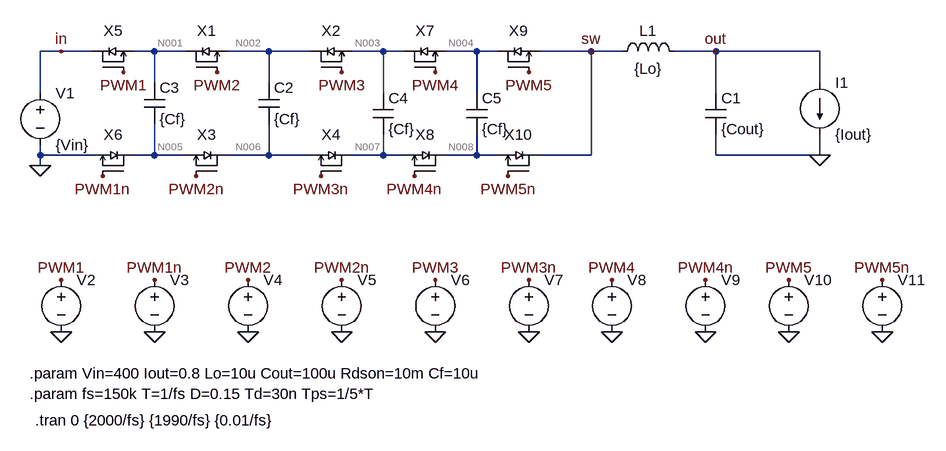
[diagram p0: schematic FCML_6Level_idealSW.asc]
FCML_6Level_idealSW.asc, the LTspice schematic file:
Version 4
SHEET 1 1308 680
WIRE -16 48 -48 48
WIRE 32 48 -16 48
WIRE 128 48 96 48
WIRE 176 48 128 48
WIRE 304 48 240 48
WIRE 368 48 304 48
WIRE 480 48 432 48
WIRE 512 48 480 48
WIRE 624 48 576 48
WIRE 656 48 624 48
WIRE 800 48 720 48
WIRE 848 48 800 48
WIRE 992 48 928 48
WIRE 1152 48 992 48
WIRE 128 96 128 48
WIRE 304 96 304 48
WIRE 1152 96 1152 48
WIRE -48 112 -48 48
WIRE 480 112 480 48
WIRE 624 112 624 48
WIRE 992 112 992 48
WIRE -48 208 -48 192
WIRE 32 208 -48 208
WIRE 128 208 128 160
WIRE 128 208 96 208
WIRE 176 208 128 208
WIRE 304 208 304 160
WIRE 304 208 240 208
WIRE 368 208 304 208
WIRE 480 208 480 176
WIRE 480 208 432 208
WIRE 512 208 480 208
WIRE 624 208 624 176
WIRE 624 208 576 208
WIRE 656 208 624 208
WIRE 800 208 800 48
WIRE 800 208 720 208
WIRE 992 208 992 176
WIRE 1152 208 1152 176
WIRE 1152 208 992 208
WIRE -48 224 -48 208
FLAG -48 224 0
FLAG 1152 208 0
FLAG -16 480 0
FLAG -16 400 PWM1
FLAG 128 480 0
FLAG 128 400 PWM1n
FLAG 272 480 0
FLAG 272 400 PWM2
FLAG 416 480 0
FLAG 416 400 PWM2n
FLAG -16 48 in
FLAG 800 48 sw
FLAG 992 48 out
FLAG 192 240 PWM2n
FLAG 416 80 PWM3
FLAG 384 240 PWM3n
FLAG 80 80 PWM1
FLAG 48 240 PWM1n
FLAG 560 480 0
FLAG 560 400 PWM3
FLAG 704 480 0
FLAG 704 400 PWM3n
FLAG 560 80 PWM4
FLAG 528 240 PWM4n
FLAG 832 480 0
FLAG 832 400 PWM4
FLAG 976 480 0
FLAG 976 400 PWM4n
FLAG 224 80 PWM2
FLAG 704 80 PWM5
FLAG 672 240 PWM5n
FLAG 1104 480 0
FLAG 1104 400 PWM5
FLAG 1248 480 0
FLAG 1248 400 PWM5n
SYMBOL voltage -48 96 R0
WINDOW 123 0 0 Left 0
WINDOW 39 0 0 Left 0
SYMATTR InstName V1
SYMATTR Value {Vin}
SYMBOL IdealSwitch\\IdealSW 208 64 R0
SYMATTR InstName X1
SYMATTR SpiceLine Rdson = {Rdson}
SYMBOL IdealSwitch\\IdealSW 400 64 R0
SYMATTR InstName X2
SYMATTR SpiceLine Rdson = {Rdson}
SYMBOL IdealSwitch\\IdealSW 208 224 M0
SYMATTR InstName X3
SYMATTR SpiceLine Rdson = {Rdson}
SYMBOL IdealSwitch\\IdealSW 400 224 M0
SYMATTR InstName X4
SYMATTR SpiceLine Rdson = {Rdson}
SYMBOL ind 832 64 R270
WINDOW 0 32 56 VTop 2
WINDOW 3 5 56 VBottom 2
SYMATTR InstName L1
SYMATTR Value {Lo}
SYMATTR SpiceLine Rser=20m
SYMBOL cap 976 112 R0
SYMATTR InstName C1
SYMATTR Value {Cout}
SYMATTR SpiceLine Rser=1m
SYMBOL current 1152 96 R0
WINDOW 123 0 0 Left 0
WINDOW 39 0 0 Left 0
SYMATTR InstName I1
SYMATTR Value {Iout}
SYMBOL cap 288 96 R0
SYMATTR InstName C2
SYMATTR Value {Cf}
SYMATTR SpiceLine Rser=1m
SYMBOL voltage -16 384 R0
WINDOW 3 24 96 Invisible 2
WINDOW 123 0 0 Left 0
WINDOW 39 0 0 Left 0
SYMATTR Value PULSE(0 5 0 1n 1n {D*T} {T})
SYMATTR InstName V2
SYMBOL voltage 128 384 R0
WINDOW 3 24 96 Invisible 2
SYMATTR Value PULSE(0 5 {D*T+Td} 1n 1n {T-D*T-2*Td} {T})
SYMATTR InstName V3
SYMBOL voltage 272 384 R0
WINDOW 3 24 96 Invisible 2
WINDOW 123 0 0 Left 0
WINDOW 39 0 0 Left 0
SYMATTR Value PULSE(0 5 {Tps} 1n 1n {D*T} {T})
SYMATTR InstName V4
SYMBOL voltage 416 384 R0
WINDOW 3 24 96 Invisible 2
WINDOW 123 0 0 Left 0
WINDOW 39 0 0 Left 0
SYMATTR Value PULSE(0 5 {Tps+D*T+Td} 1n 1n {T-D*T-2*Td} {T})
SYMATTR InstName V5
SYMBOL IdealSwitch\\IdealSW 64 64 R0
SYMATTR InstName X5
SYMATTR SpiceLine Rdson = {Rdson}
SYMBOL IdealSwitch\\IdealSW 64 224 M0
SYMATTR InstName X6
SYMATTR SpiceLine Rdson = {Rdson}
SYMBOL cap 112 96 R0
SYMATTR InstName C3
SYMATTR Value {Cf}
SYMATTR SpiceLine Rser=1m
SYMBOL voltage 560 384 R0
WINDOW 3 24 96 Invisible 2
WINDOW 123 0 0 Left 0
WINDOW 39 0 0 Left 0
SYMATTR Value PULSE(0 5 {Tps*2} 1n 1n {D*T} {T})
SYMATTR InstName V6
SYMBOL voltage 704 384 R0
WINDOW 3 24 96 Invisible 2
WINDOW 123 0 0 Left 0
WINDOW 39 0 0 Left 0
SYMATTR Value PULSE(0 5 {Tps*2+D*T+Td} 1n 1n {T-D*T-2*Td} {T})
SYMATTR InstName V7
SYMBOL IdealSwitch\\IdealSW 544 64 R0
SYMATTR InstName X7
SYMATTR SpiceLine Rdson = {Rdson}
SYMBOL IdealSwitch\\IdealSW 544 224 M0
SYMATTR InstName X8
SYMATTR SpiceLine Rdson = {Rdson}
SYMBOL cap 464 112 R0
SYMATTR InstName C4
SYMATTR Value {Cf}
SYMATTR SpiceLine Rser=1m
SYMBOL voltage 832 384 R0
WINDOW 3 24 96 Invisible 2
WINDOW 123 0 0 Left 0
WINDOW 39 0 0 Left 0
SYMATTR Value PULSE(0 5 {Tps*3} 1n 1n {D*T} {T})
SYMATTR InstName V8
SYMBOL voltage 976 384 R0
WINDOW 3 24 96 Invisible 2
WINDOW 123 0 0 Left 0
WINDOW 39 0 0 Left 0
SYMATTR Value PULSE(0 5 {Tps*3+D*T+Td} 1n 1n {T-D*T-2*Td} {T})
SYMATTR InstName V9
SYMBOL IdealSwitch\\IdealSW 688 64 R0
SYMATTR InstName X9
SYMATTR SpiceLine Rdson = {Rdson}
SYMBOL IdealSwitch\\IdealSW 688 224 M0
SYMATTR InstName X10
SYMATTR SpiceLine Rdson = {Rdson}
SYMBOL cap 608 112 R0
SYMATTR InstName C5
SYMATTR Value {Cf}
SYMATTR SpiceLine Rser=1m
SYMBOL voltage 1104 384 R0
WINDOW 3 24 96 Invisible 2
WINDOW 123 0 0 Left 0
WINDOW 39 0 0 Left 0
SYMATTR Value PULSE(0 5 {Tps*4} 1n 1n {D*T} {T})
SYMATTR InstName V10
SYMBOL voltage 1248 384 R0
WINDOW 3 24 96 Invisible 2
WINDOW 123 0 0 Left 0
WINDOW 39 0 0 Left 0
SYMATTR Value PULSE(0 5 {Tps*4+D*T+Td} 1n 1n {T-D*T-2*Td} {T})
SYMATTR InstName V11
TEXT -64 544 Left 2 !.param Vin=400 Iout=0.8 Lo=10u Cout=100u Rdson=10m Cf=10u\n.param fs=150k T=1/fs D=0.15 Td=30n Tps=1/5*T
TEXT -56 616 Left 2 !.tran 0 {2000/fs} {1990/fs} {0.01/fs}

The netlist it stands for:
* FCML_6Level_idealSW.asc
V1 in 0 {Vin}
XX1 N001 PWM2 N002 IdealSW params: Rdson = {Rdson}  ; pins D G S
XX2 N002 PWM3 N003 IdealSW params: Rdson = {Rdson}  ; pins D G S
XX3 N006 PWM2n N005 IdealSW params: Rdson = {Rdson}  ; pins D G S
XX4 N007 PWM3n N006 IdealSW params: Rdson = {Rdson}  ; pins D G S
L1 sw out {Lo} Rser=20m
C1 out 0 {Cout} Rser=1m
I1 out 0 {Iout}
C2 N002 N006 {Cf} Rser=1m
V2 PWM1 0 PULSE(0 5 0 1n 1n {D*T} {T})
V3 PWM1n 0 PULSE(0 5 {D*T+Td} 1n 1n {T-D*T-2*Td} {T})
V4 PWM2 0 PULSE(0 5 {Tps} 1n 1n {D*T} {T})
V5 PWM2n 0 PULSE(0 5 {Tps+D*T+Td} 1n 1n {T-D*T-2*Td} {T})
XX5 in PWM1 N001 IdealSW params: Rdson = {Rdson}  ; pins D G S
XX6 N005 PWM1n 0 IdealSW params: Rdson = {Rdson}  ; pins D G S
C3 N001 N005 {Cf} Rser=1m
V6 PWM3 0 PULSE(0 5 {Tps*2} 1n 1n {D*T} {T})
V7 PWM3n 0 PULSE(0 5 {Tps*2+D*T+Td} 1n 1n {T-D*T-2*Td} {T})
XX7 N003 PWM4 N004 IdealSW params: Rdson = {Rdson}  ; pins D G S
XX8 N008 PWM4n N007 IdealSW params: Rdson = {Rdson}  ; pins D G S
C4 N003 N007 {Cf} Rser=1m
V8 PWM4 0 PULSE(0 5 {Tps*3} 1n 1n {D*T} {T})
V9 PWM4n 0 PULSE(0 5 {Tps*3+D*T+Td} 1n 1n {T-D*T-2*Td} {T})
XX9 N004 PWM5 sw IdealSW params: Rdson = {Rdson}  ; pins D G S
XX10 sw PWM5n N008 IdealSW params: Rdson = {Rdson}  ; pins D G S
C5 N004 N008 {Cf} Rser=1m
V10 PWM5 0 PULSE(0 5 {Tps*4} 1n 1n {D*T} {T})
V11 PWM5n 0 PULSE(0 5 {Tps*4+D*T+Td} 1n 1n {T-D*T-2*Td} {T})
.param Vin=400 Iout=0.8 Lo=10u Cout=100u Rdson=10m Cf=10u
.param fs=150k T=1/fs D=0.15 Td=30n Tps=1/5*T
.tran 0 {2000/fs} {1990/fs} {0.01/fs}
.backanno
.end

* Results of the author's LTspice run, read from the files saved beside the schematic
* Operating Point, zero values left out:
*   V(in) = 400 V
*   V(n002) = 240 V
*   V(n001) = 320 V
*   V(n003) = 160 V
*   V(n005) = -7.998 mV
*   V(n006) = -16 mV
*   V(n007) = -24 mV
*   V(sw) = -39.99 mV
*   V(out) = -55.99 mV
*   V(n004) = 79.97 V
*   V(n008) = -31.99 mV
*   I(L1) = 800 mA
*   I(I1) = 800 mA
*   I(V1) = -160 µA
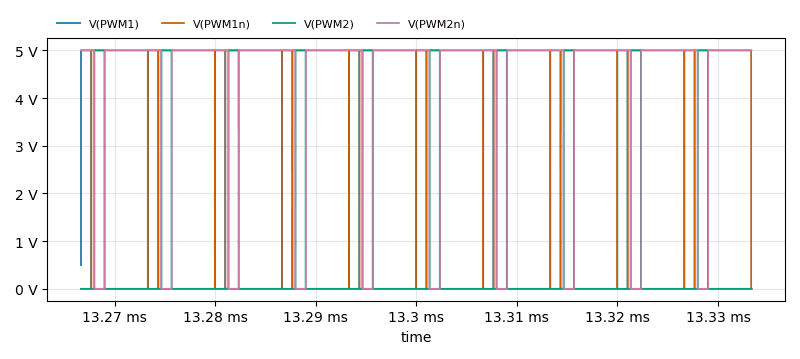
[diagram p1: Transient Analysis of FCML_6Level_idealSW.asc, plotted from the saved traces]
* Transient Analysis, 1 run:
*   V(PWM1): min 0 V, max 5 V, average 750.8 mV, rms 1.937 V, last 0 V
*   V(PWM1n): min 0 V, max 5 V, average 4.206 V, rms 4.586 V, last 0 V
*   V(PWM2): min 0 V, max 5 V, average 750.8 mV, rms 1.937 V, last 0 V
*   V(PWM2n): min 0 V, max 5 V, average 4.206 V, rms 4.586 V, last 5 V